# EAGLE schematic ShowStopper REV C (EAGLE 5.00)
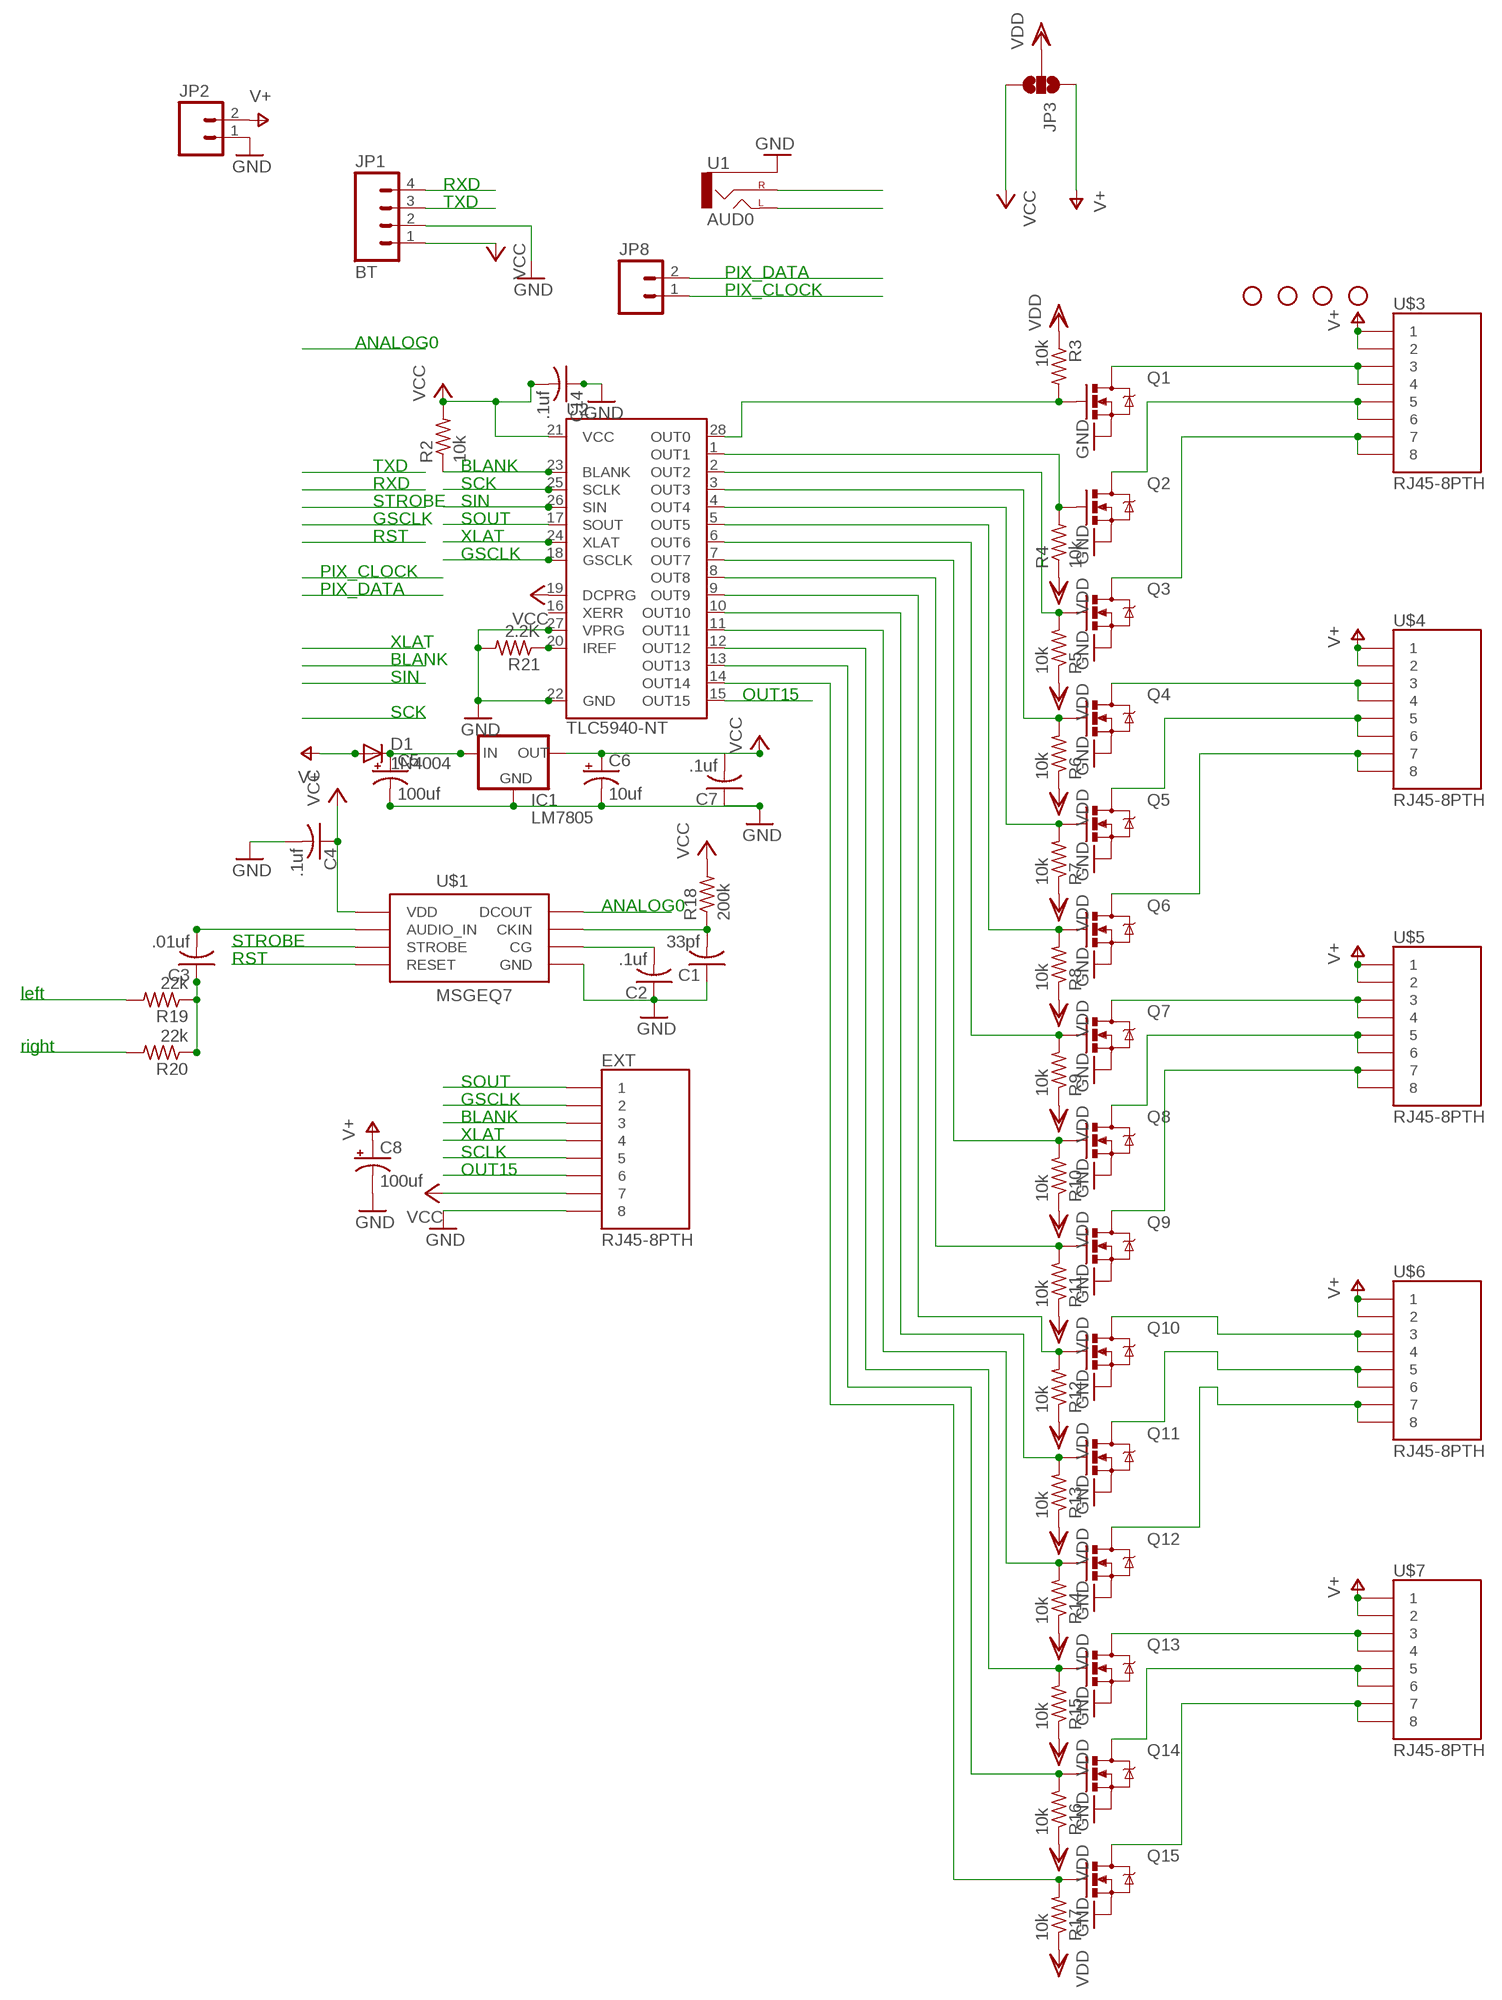
[diagram p0: schematic, sheet 1]

## Parts
C1  33pf  C-US025-025X050  [C025-025X050]
C2  .1uf  C-US025-025X050  [C025-025X050]
C3  .01uf  C-US025-025X050  [C025-025X050]
C4  .1uf  C-US025-025X050  [C025-025X050]
C5  100uf  CAP_POLPTH1  [CPOL-RADIAL-100UF-25V]
C6  10uf  CAP_POLPTH2  [CPOL-RADIAL-10UF-25V]
C7  .1uf  C-US025-025X050  [C025-025X050]
C8  100uf  CAP_POLPTH1  [CPOL-RADIAL-100UF-25V]
C14  .1uf  C-US025-025X050  [C025-025X050]
D1  1N4004  DIODEPTH  [DIODE-1N4001]
EXT  RJ45-8PTH  [RJ45-8]
IC1  LM7805  V_REG_78XXSINK  [TO220-IGO]
JP1  BT  M04LOCK  [1X04_LOCK]
JP2  M025MM  [SCREWTERMINAL-5MM-2]
JP3  SOLDERJUMPER_2WAYW  [SJ_2W]
JP4  STAND-OFF  [STAND-OFF]
JP5  STAND-OFF  [STAND-OFF]
JP6  STAND-OFF  [STAND-OFF]
JP7  STAND-OFF  [STAND-OFF]
JP8  M023.5MM  [SCREWTERMINAL-3.5MM-2]
Q1  MOSFET-NCHANNELPTH2  [TO220V]
Q2  MOSFET-NCHANNELPTH2  [TO220V]
Q3  MOSFET-NCHANNELPTH2  [TO220V]
Q4  MOSFET-NCHANNELPTH2  [TO220V]
Q5  MOSFET-NCHANNELPTH2  [TO220V]
Q6  MOSFET-NCHANNELPTH2  [TO220V]
Q7  MOSFET-NCHANNELPTH2  [TO220V]
Q8  MOSFET-NCHANNELPTH2  [TO220V]
Q9  MOSFET-NCHANNELPTH2  [TO220V]
Q10  MOSFET-NCHANNELPTH2  [TO220V]
Q11  MOSFET-NCHANNELPTH2  [TO220V]
Q12  MOSFET-NCHANNELPTH2  [TO220V]
Q13  MOSFET-NCHANNELPTH2  [TO220V]
Q14  MOSFET-NCHANNELPTH2  [TO220V]
Q15  MOSFET-NCHANNELPTH2  [TO220V]
R2  10k  R-US_0207/2V  [0207/2V]
R3  10k  R-US_0207/2V  [0207/2V]
R4  10k  R-US_0207/2V  [0207/2V]
R5  10k  R-US_0207/2V  [0207/2V]
R6  10k  R-US_0207/2V  [0207/2V]
R7  10k  R-US_0207/2V  [0207/2V]
R8  10k  R-US_0207/2V  [0207/2V]
R9  10k  R-US_0207/2V  [0207/2V]
R10  10k  R-US_0207/2V  [0207/2V]
R11  10k  R-US_0207/2V  [0207/2V]
R12  10k  R-US_0207/2V  [0207/2V]
R13  10k  R-US_0207/2V  [0207/2V]
R14  10k  R-US_0207/2V  [0207/2V]
R15  10k  R-US_0207/2V  [0207/2V]
R16  10k  R-US_0207/2V  [0207/2V]
R17  10k  R-US_0207/2V  [0207/2V]
R18  200k  R-US_0207/2V  [0207/2V]
R19  22k  R-US_0207/2V  [0207/2V]
R20  22k  R-US_0207/2V  [0207/2V]
R21  2.2K  R-US_0207/2V  [0207/2V]
U1  AUD0  AUDIO-JACKPTH  [AUDIO-JACK]
U2  TLC5940-NT  [DIL28-3]
U$1  MSGEQ7_PTH  [DIL08]
U$3  RJ45-8PTH  [RJ45-8]
U$4  RJ45-8PTH  [RJ45-8]
U$5  RJ45-8PTH  [RJ45-8]
U$6  RJ45-8PTH  [RJ45-8]
U$7  RJ45-8PTH  [RJ45-8]

## Nets
ANALOG0: U$1.3(DCOUT)
BLANK: EXT.3 R2.1 U2.23(BLANK)
GND: C1.1 C2.1 C4.2 C5.2(-) C6.2(-) C7.1 C8.2(-) C14.1 EXT.8 IC1.GND JP1.2 JP2.1 Q1.3(S) Q2.3(S) Q3.3(S) Q4.3(S) Q5.3(S) Q6.3(S) Q7.3(S) Q8.3(S) Q9.3(S) Q10.3(S) Q11.3(S) Q12.3(S) Q13.3(S) Q14.3(S) Q15.3(S) R21.2 U1.SLEEVE U2.22(GND) U2.27(VPRG) U$1.2(GND)
GSCLK: EXT.2 U2.18(GSCLK)
LEFT: R19.2 U1.TIP(LEFT)
N$1: Q7.2(D) U$5.3 U$5.4
N$2: Q2.2(D) U$3.5 U$3.6
N$3: Q3.2(D) U$3.7 U$3.8
N$4: Q10.2(D) U$6.3 U$6.4
N$5: Q9.1(G) R11.2 U2.8(OUT8)
N$6: Q2.1(G) R4.2 U2.1(OUT1)
N$7: Q3.1(G) R5.2 U2.2(OUT2)
N$8: Q4.1(G) R6.2 U2.3(OUT3)
N$9: Q5.2(D) U$4.5 U$4.6
N$10: Q5.1(G) R7.2 U2.4(OUT4)
N$11: Q6.1(G) R8.2 U2.5(OUT5)
N$12: Q7.1(G) R9.2 U2.6(OUT6)
N$13: Q8.1(G) R10.2 U2.7(OUT7)
N$15: Q10.1(G) R12.2 U2.9(OUT9)
N$16: Q11.1(G) R13.2 U2.10(OUT10)
N$17: Q12.1(G) R14.2 U2.11(OUT11)
N$18: Q13.1(G) R15.2 U2.12(OUT12)
N$19: Q14.1(G) R16.2 U2.13(OUT13)
N$20: Q15.1(G) R17.2 U2.14(OUT14)
N$21: Q6.2(D) U$4.7 U$4.8
N$22: Q13.2(D) U$7.3 U$7.4
N$23: Q8.2(D) U$5.5 U$5.6
N$24: C1.2 R18.1 U$1.8(CKIN)
N$25: Q9.2(D) U$5.7 U$5.8
N$26: Q14.2(D) U$7.5 U$7.6
N$27: Q11.2(D) U$6.5 U$6.6
N$28: C3.2 U$1.5(AUDIO_IN)
N$29: Q12.2(D) U$6.7 U$6.8
N$30: Q15.2(D) U$7.7 U$7.8
N$31: Q1.2(D) U$3.3 U$3.4
N$32: C2.2 U$1.6(CG)
N$33: Q4.2(D) U$4.3 U$4.4
N$34: Q1.1(G) R3.2 U2.28(OUT0)
N$35: R21.1 U2.20(IREF)
N$36: C3.1 R19.1 R20.1
N$40: C5.1(+) D1.C IC1.IN
OUT15: EXT.6 U2.15(OUT15)
PIX_CLOCK: JP8.1
PIX_DATA: JP8.2
RIGHT: R20.2 U1.RING(RIGHT)
RST: U$1.7(RESET)
RXD: JP1.4
SCK: EXT.5 U2.25(SCLK)
SIN: U2.26(SIN)
SOUT: EXT.1 U2.17(SOUT)
STROBE: U$1.4(STROBE)
TXD: JP1.3
V+: C8.1(+) D1.A JP2.2 JP3.1 U$3.1 U$3.2 U$4.1 U$4.2 U$5.1 U$5.2 U$6.1 U$6.2 U$7.1 U$7.2
VCC: C4.1 C6.1(+) C7.2 C14.2 EXT.7 IC1.OUT JP1.1 JP3.3 R2.2 R18.2 U2.19(DCPRG) U2.21(VCC) U$1.1(VDD)
VDD: JP3.2 R3.1 R4.1 R5.1 R6.1 R7.1 R8.1 R9.1 R10.1 R11.1 R12.1 R13.1 R14.1 R15.1 R16.1 R17.1
XLAT: EXT.4 U2.24(XLAT)
Unconnected: U2.16(XERR)

## Notes on the sheet
- RXD
- TXD
- PIX_DATA
- PIX_CLOCK
- ANALOG0
- TXD | BLANK
- RXD | SCK
- STROBE | SIN
- GSCLK | SOUT
- RST | XLAT
- GSCLK
- PIX_CLOCK
- PIX_DATA
- XLAT
- BLANK
- SIN
- OUT15
- SCK
- ANALOG0
- STROBE
- RST
- left
- right
- SOUT
- GSCLK
- BLANK
- XLAT
- SCLK
- OUT15

## Library data of the parts
C1-C4 C7 C14 = resistor:C-US: CAPACITOR, American symbol
C5 C6 C8 = SparkFun:CAP_POL: Capacitor Polarized These are standard SMD and PTH capacitors. Normally 10uF, 47uF, and 100uF in electrolytic and tantalum varieties. Always verify the external diameter of the through hole cap, it varies with capacity, voltage, and manufacturer. The EIA devices should be standard.
D1 = SparkFun:DIODE: Diode These are standard reverse protection diodes and small signal diodes. SMA package can handle up to about 1A. SOD-323 can handle about 200mA. What the SOD-323 package when ordering, there are some mfgs out there that are 5-pin packages.
EXT U$3-U$7 = SparkFun:RJ45-8: RJ45 Jack Simple RJ45, 8-pin connection - connector for common Cat5, Cat5e, and Cat6 Ethernet cables. Footprint not yet proven in production. Connector sku is PRT-00643; Breakout PCB sku is BOB-00716.
IC1 = SparkFun:V_REG_78XX: Voltage Regulator Standard 7805 5V regulator. IGO (Input Ground Output). Spark Fun Electronics SKU : COM-00107
JP1 = SparkFun:M04: Header 4 Standard 4-pin 0.1" header. Use with straight break away headers (SKU : PRT-00116), right angle break away headers (PRT-00553), swiss pins (PRT-00743), machine pins (PRT-00117), and female headers (PRT-00115). Molex polarized connector foot print use with SKU : PRT-08231 with associated crimp pins and housings. 1MM SMD Version SKU: PRT-10208
JP2 JP8 = SparkFun:M02: Header 2 Standard 2-pin 0.1" header. Use with straight break away headers (SKU : PRT-00116), right angle break away headers (PRT-00553), swiss pins (PRT-00743), machine pins (PRT-00117), and female headers (PRT-00115). Molex polarized connector foot print use with SKU : PRT-08233 with associated crimp pins and housings.
JP3 = SparkFun:SOLDERJUMPER_2WAY: Solder Jumper 2 way solder jumper
JP4-JP7 = SparkFun:STAND-OFF: Stand Off This is the mechanical footprint for a #4 phillips button head screw. Use the keepout ring to avoid running the screw head into surrounding components. SKU : PRT-00447
Q1-Q15 = SparkFun:MOSFET-NCHANNEL
R2-R21 = resistor:R-US_: RESISTOR, American symbol
U1 = SparkFun:AUDIO-JACK: 3.5mm Audio Jack Simple 3.5mm common PCB mount audio jack. SKU: PRT-08032
U2 = SparkFun:TLC5940: TI TLC5940 16-channel LED Driver with Dot Correction and Grayscale PWM Control The TLC5940 is a 16-channel, constant-current sink LED driver. Each channel has an individually adjustable 4096-step grayscale PWM brightness control and a 64-step, constant-current sink (dot correction). The dot correction adjusts the brightness variations between LED channels and other LED drivers. The dot correction data is stored in an integrated EEPROM. Both grayscale control and dot correction are accessible via a serial interface. A single external resistor sets the maximum current value of all 16 channels. Packages: 28-pin HTSSOP 32-pin 5x5mm QFN 28-pin DIP
U$1 = SparkFun:MSGEQ7_PTH